# EAGLE design ClockUSB (EAGLE 9.6.2)

## Sheet 1 of 2
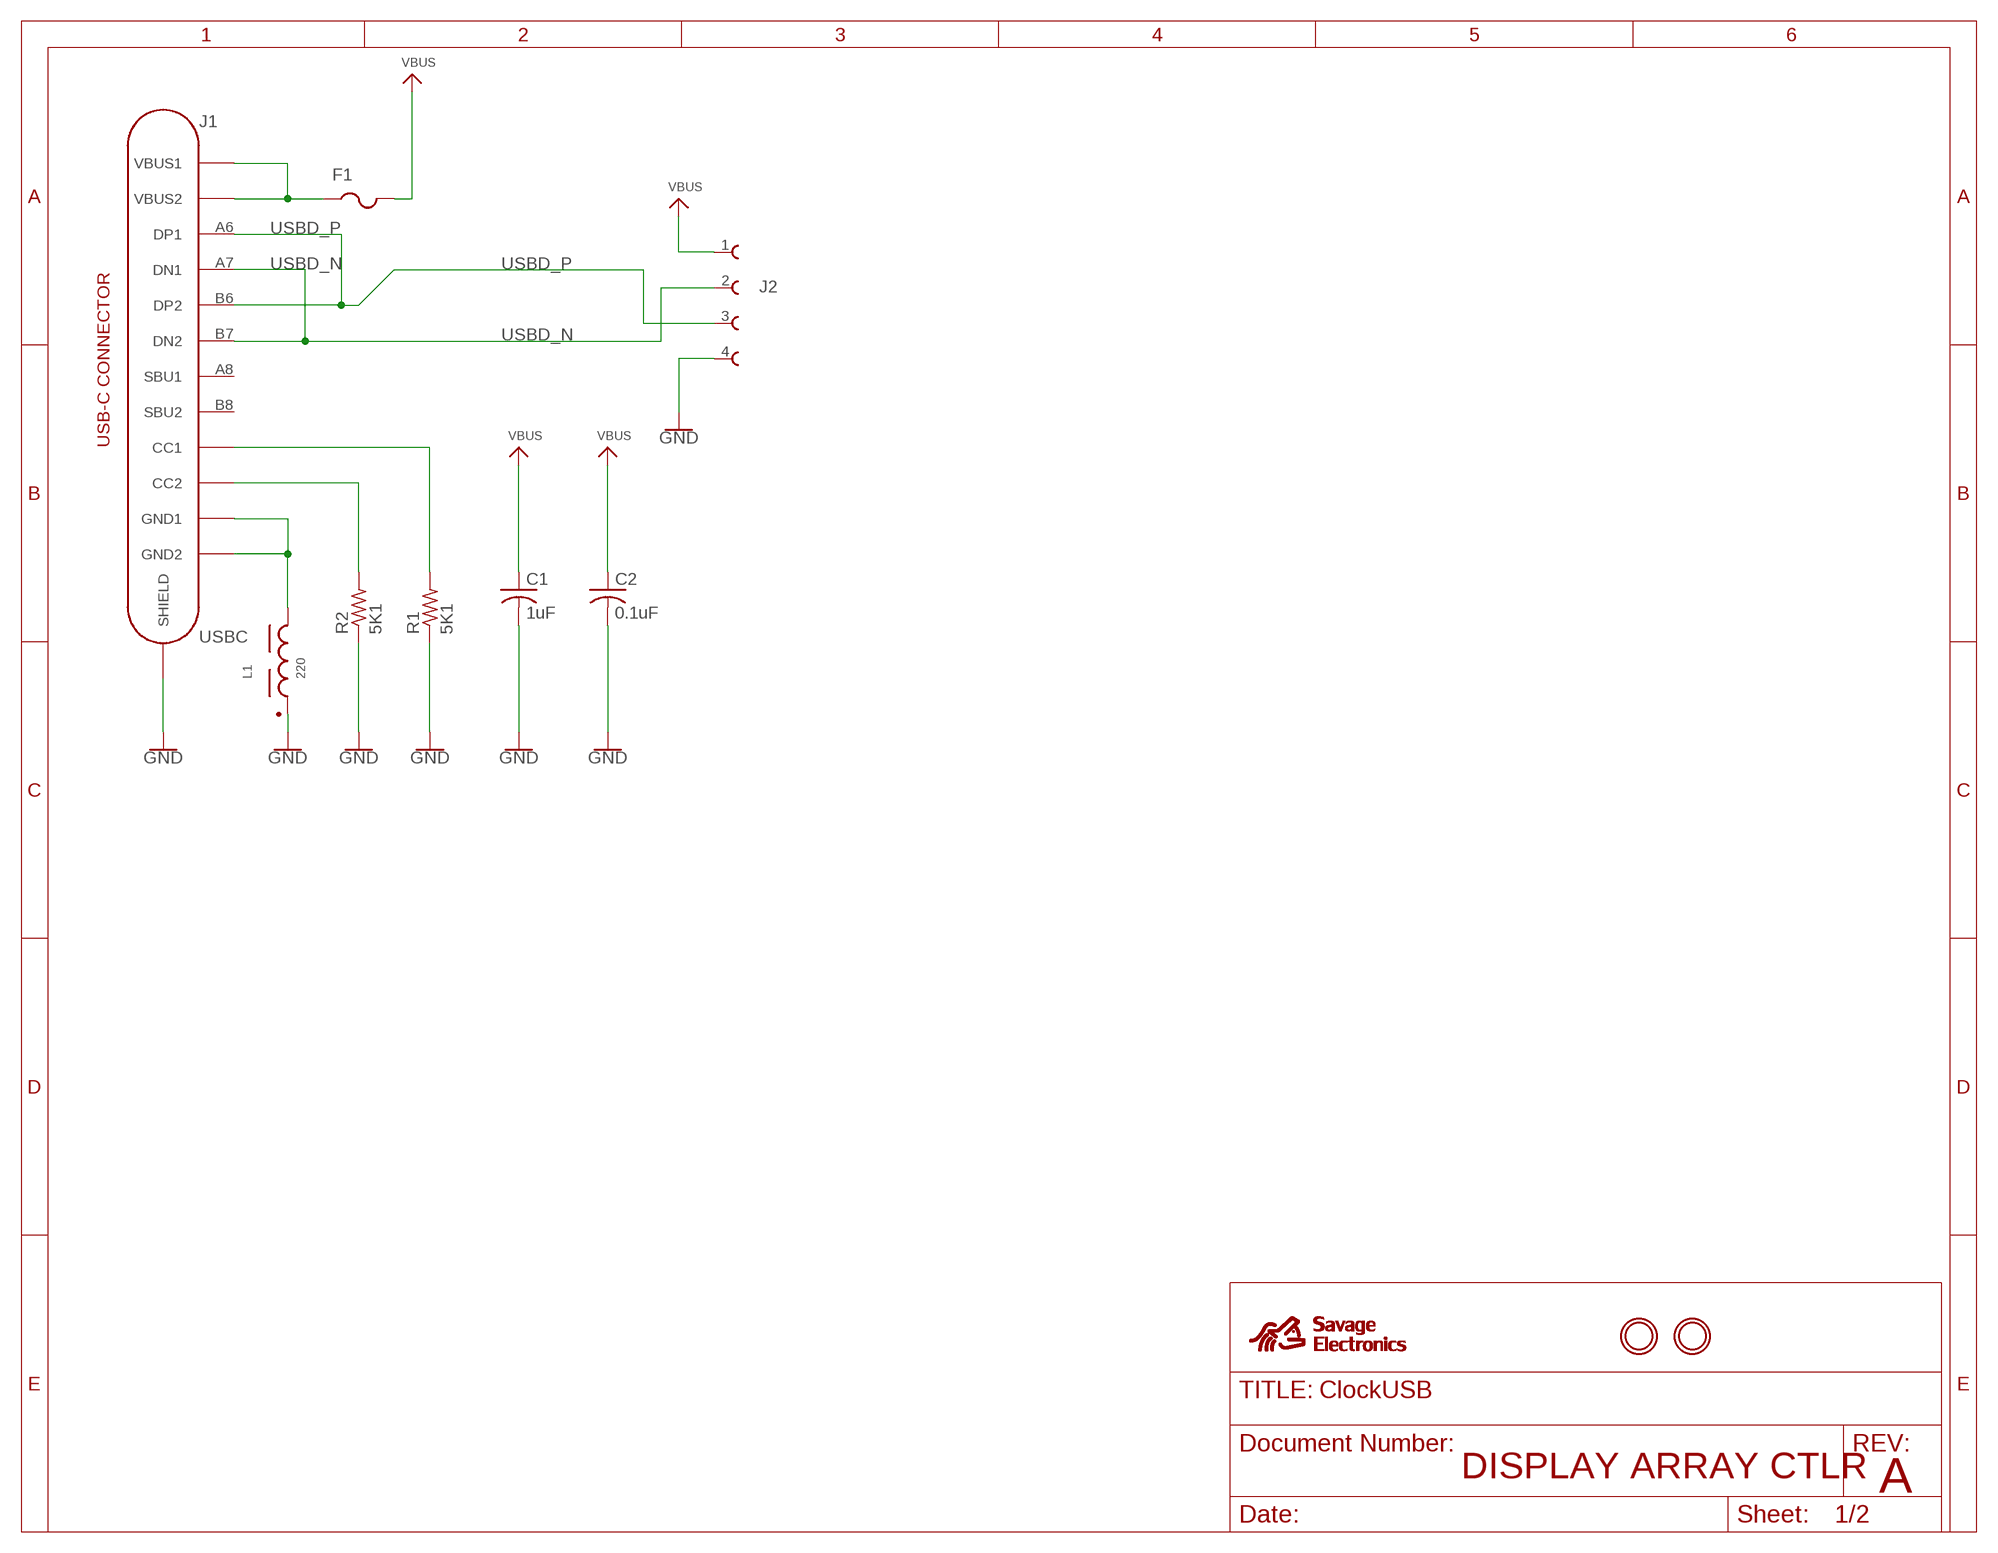
[diagram p0: schematic, sheet 1]

### Parts
C1  1uF  C-USC0603  [C0603]
C2  0.1uF  C-USC0603  [C0603]
F1  PTCFUSE  [R0603]
J1  USBC  [USBC]
J2  62000411121  [62000411121]
L1  220  WE-CBA_0603_782631182_WB/HS  [WE-CBA_0603(W=2.2)]
R1  5K1  R-US_R0603  [R0603]
R2  5K1  R-US_R0603  [R0603]
U$3  SE_SMALL_FSILK  [SE_SMALL_FACESILK]
U$6  MOUNTINGHOLE3.0THIN  [MOUNTINGHOLE_3.0_PLATEDTHIN]
U$7  MOUNTINGHOLE3.0THIN  [MOUNTINGHOLE_3.0_PLATEDTHIN]

### Nets
GND: C1.2 C2.2 J1.S1(SHIELD) J1.S2(SHIELD) J1.S3(SHIELD) J1.S4(SHIELD) J2.4 L1.1 R1.1 R2.1
N$1: J1.A1B12(GND1) J1.B1A12(GND2) L1.2
N$2: J1.B5(CC2) R2.2
N$3: J1.A5(CC1) R1.2
N$4: F1.1 J1.A4B9(VBUS1) J1.B4A9(VBUS2)
USBD_N: J1.A7(DN1) J1.B7(DN2) J2.2
USBD_P: J1.A6(DP1) J1.B6(DP2) J2.3
VBUS: C1.1 C2.1 F1.2 J2.1
Unconnected: J1.A8(SBU1) J1.B8(SBU2)

### Notes on the sheet
- DISPLAY ARRAY CTLR
- A

## Sheet 2 of 2
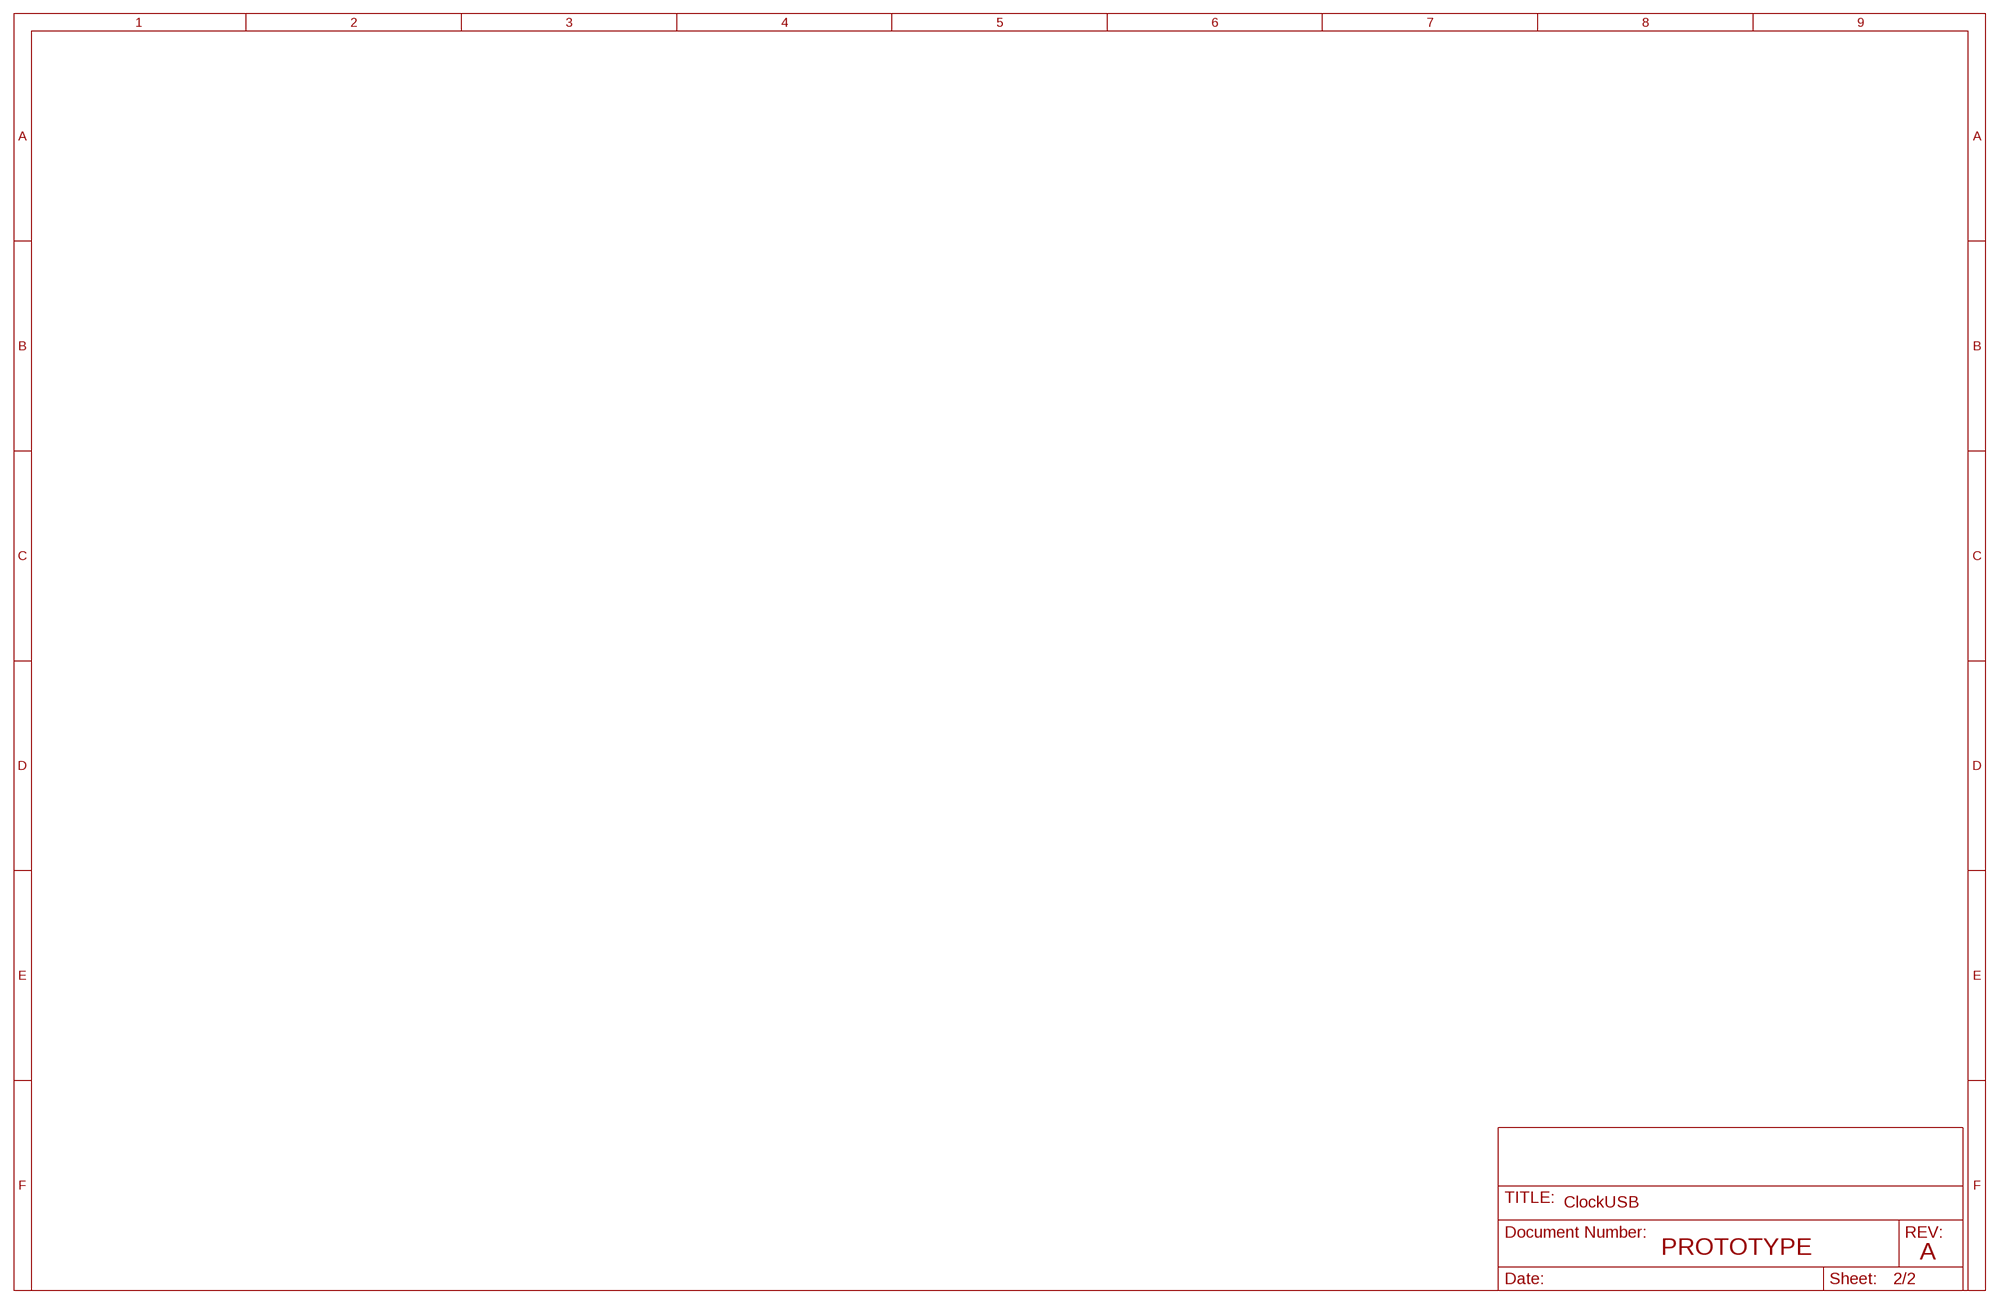
[diagram p1: schematic, sheet 2]

### Notes on the sheet
- PROTOTYPE | A

## Library data of the parts
C1 C2 = Adafruit:C-US: CAPACITOR, American symbol
F1 = Adafruit:PTCFUSE: PTC fuses, resettable thermistors
J1 = USBC:USBC
J2 = Eagle_BOARD-TO-BOARD_CONNECTORS (rev18b):62000411121: WR-PHD 2.00mm Pin Header, 4 Pins=>Code : Con_BTB_PHD_2.00_1_THT_62000411121 <http://katalog.we-online.de/media/images/eican/Con_BTB_PHD_2.00_1_THT_6200xx11121_pf2.jpg> Details see: http://katalog.we-online.de/en/em/620_0xx_111_21 Created 2014-06-03, Karrer Zheng 2014 (C) Würth Elektronik
L1 = EMCComponents (rev19b):WE-CBA_0603: WE-CBA SMD EMI Suppression Ferrite Bead Characteristics Reliable Ni-Sn electrodes High rated current up to 5A Recommended soldering: Reflow Operating temperature: -55°C to +125°C Applications * Perfect as data line filter and for uncoupling of distribution voltage *This special SMD chip bead ferrites can be put directly on the printed circuit board. They offer excellent anti-EMI properties and low DC-resistance. Placed very close next to the interference source even with smallest size 0402,maximal impedance at 1000 Ω can be reached. *High Speed: "High Speed " SMD ferrites WE-CBF have lower impedance in the lower frequency ranges thus they have only a low attenuation for fast signals. Application e.g. USB 2.0, IEEE 1394,LVDS *Wide Band: "Wide Band" SMD ferrites WE-CBF already show high impedance in low frequency range. Therefore they are wide band through the whole spectrum. Application e.g. control signats, RS232, RS422, DC/DC converter *High Current: "High Current " SMD ferrites WE-CBF are designed for high current (over 1 A). The rated current refers to 40K self-heating. High current SMD ferrites are available in all there types (High Speed, Wide Band and High Frequency). Application e.g. power supply, DC/DC converter *Advice: Pay attention for the use of SMD-Ferrites for high current>1A and ambient temperature over +85°C that the rated current has to be reduced when temperature is above +85°C (Derating). *At+100°C environment temperature the maximal rated current has to add up to only 60% of the data sheet value ,without an overload of the component. Variant abbreviation WB means WIDE BAND HS means HIGH SPEED HC means HIGH CURRENT <http://katalog.we-online.de/media/images/v2/Family_WE-CBA.jpg> Details see: http://katalog.we-online.de/en/pbs/WE-CBA/ Created: 2015-02-02 2015 (C) Wurth Elektronik
R1 R2 = Adafruit:R-US_: RESISTOR, American symbol
U$3 = SE_NEWLOGO:SE_SMALL_FSILK
U$6 U$7 = Plated Holes:MOUNTINGHOLE: Mounting Hole For #2 screws (0.086"/2.18mm width, 0.094"/2.4mm hole) use 2.5mm; BOM: EXCLUDE

## Board
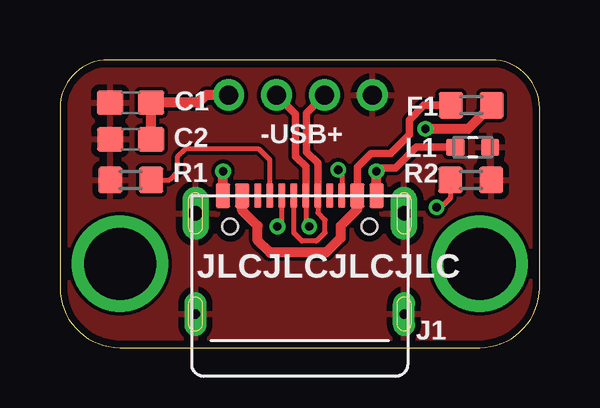
[diagram p2: board, top side]
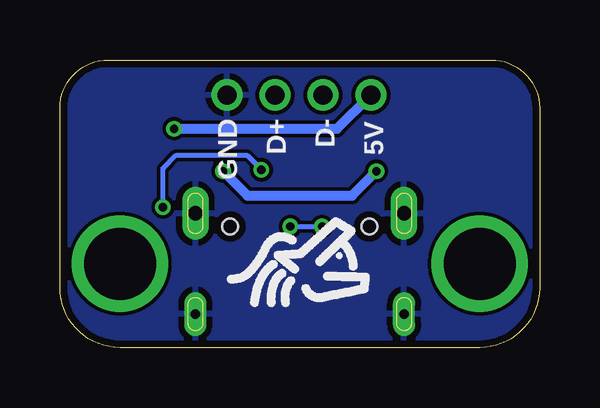
[diagram p3: board, bottom side, seen from below]

Size 20 x 12 mm. Coordinates in mm from the lower left corner, seen from the top.
Outline: 20,2.5 20,10 arc90 18,12 2,12 arc90 0,10 0,2.5 arc90 2.5,0 17.5,0 arc90 20,2.5
Copper layers (1*16): Top 0.035mm / dielectric 1.5mm / Bottom 0.035mm
Design rules "default *": minimum track width 5mil, minimum drill 0.3mm, track to track 6mil, track to pad 5mil, pad to pad 5mil, via to via 5mil, smd to smd 5mil, copper to edge 12mil, drill to drill 6mil, minimum pad ring 10mil, minimum via ring 6mil, stop-mask expansion 2mil, vias tented up to drill 20mil, thermal gap 10mil

### Footprints (pad centres in the part's own frame; a part is rotated, then mirrored left to right if it is on the bottom)
C0603 = smd 1.1 x 1: 1 -0.85,0; 2 0.85,0
R0603 = smd 1 x 1.1: 1 -0.85,0; 2 0.85,0
USBC = smd 0.6 x 1.016: A1B12 -3.2,3.592; A4B9 -2.4,3.592; B1A12 3.2,3.592; B4A9 2.4,3.592 | smd 0.3 x 1.016: A5 -1.25,3.592; A6 -0.25,3.592; A7 0.25,3.592; A8 1.25,3.592; B5 1.75,3.592; B6 0.75,3.592; B7 -0.75,3.592; B8 -1.75,3.592 | drill 0.6 long: S1 -4.35,2.85; S2 4.35,2.85 | drill 0.4 long: S3 -4.35,-1.35; S4 4.35,-1.35 | hole 0.65: -2.9,2.3; 2.9,2.3
62000411121 = drill 0.8: 1 -3,0; 2 -1,0; 3 1,0; 4 3,0
WE-CBA_0603(W=2.2) = smd 0.75 x 0.7: 1 -0.725,0; 2 0.725,0
MOUNTINGHOLE_3.0_PLATEDTHIN = drill 3 pad 3.6: P$1 0,0

### Placement (x,y rotation side)
C1  2.95,10.22 180 top
C2  2.95,8.69 180 top
F1  17.15,10.11 0 top
J1  10,2.75 0 top
J2  10.03,10.54 0 top
L1  17.21,8.35 180 top
R1  2.95,7 0 top
R2  17.13,7 180 top
U$3  13.22,1.52 0 bottom
U$6  2.5,3.5 0 top
U$7  17.5,3.5 0 top

### Tracks (layer width: path | path; a pad name or v marks a point on that pad's centre or on a via)
GND
  pour Top: 0,2.5 0,10 arc-90 2,12 18,12 arc-90 20,10 20,2.5 arc-90 17.5,0 2.5,0 arc-90
  pour Bottom: 0,2.5 0,10 arc-90 2,12 18,12 arc-90 20,10 20,2.5 arc-90 17.5,0 2.5,0 arc-90
N$1  (via drill 0.35)
  Top 0.305: L1.2 14.86,8.35 13.99,7.49 13.33,7.49 v13.2,7.36
  Top 0.406: J1.A1B12 v6.8,7.36 | J1.B1A12 v13.2,7.36
  Bottom 0.406: v13.2,7.36 12.18,6.34 7.82,6.34 v6.8,7.36
N$2  (via drill 0.35)
  Top 0.203: R2.2 16.28,6.24 15.9,5.86 v15.7,5.86 | v11.6,7.42 11.75,7.26 J1.B5
  Bottom 0.203: v15.7,5.86 15.7,7.47 15.15,8.03 12.21,8.03 v11.6,7.42
N$3
  Top 0.203: J1.A5 8.75,7.83 8.3,8.28 5.23,8.28 4.89,7.94 4.89,7.32 4.57,7 R1.2
N$4
  Top 0.305: J1.B4A9 12.4,7.52 12.97,8.09 13.78,8.09 14.58,8.89 14.58,9.5 15.19,10.11 F1.1
  Top 0.406: J1.B4A9 12.4,5.78 11.7,5.08 11.7,4.57 11.09,3.96 8.75,3.96 8.25,4.47 8.25,5.08 7.6,5.73 J1.A4B9
USBD_N  (via drill 0.35)
  Top 0.203: J1.A7 10.25,5.19 v10.39,5.05 | v9.07,5.05 9.25,5.23 J1.B7
  Top 0.305: J1.A7 10.25,7.55 9.82,7.98 9.82,9.75 J2.2
  Bottom 0.203: v10.39,5.05 v9.07,5.05
USBD_P
  Top 0.203: J1.B6 10.75,5.63 11.05,5.33 11.05,4.8 10.7,4.44 10.09,4.44 9.75,4.78 J1.A6
  Top 0.305: J1.B6 10.75,7.69 10.28,8.16 10.28,9.78 J2.3
VBUS  (via drill 0.35)
  Top 0.406: J2.1 6.1,10.54 5.78,10.22 C1.1 C2.1 | F1.2 17.03,9.13 v15.24,9.13
  Bottom 0.406: J2.1 8.44,9.13 v15.24,9.13

### Text on the board
tPlace: -USB+ | JLCJLCJLCJLC
bPlace: D- | D+ | GND | 5V